# EAGLE design UV Sterlizer (EAGLE 9.6.1)
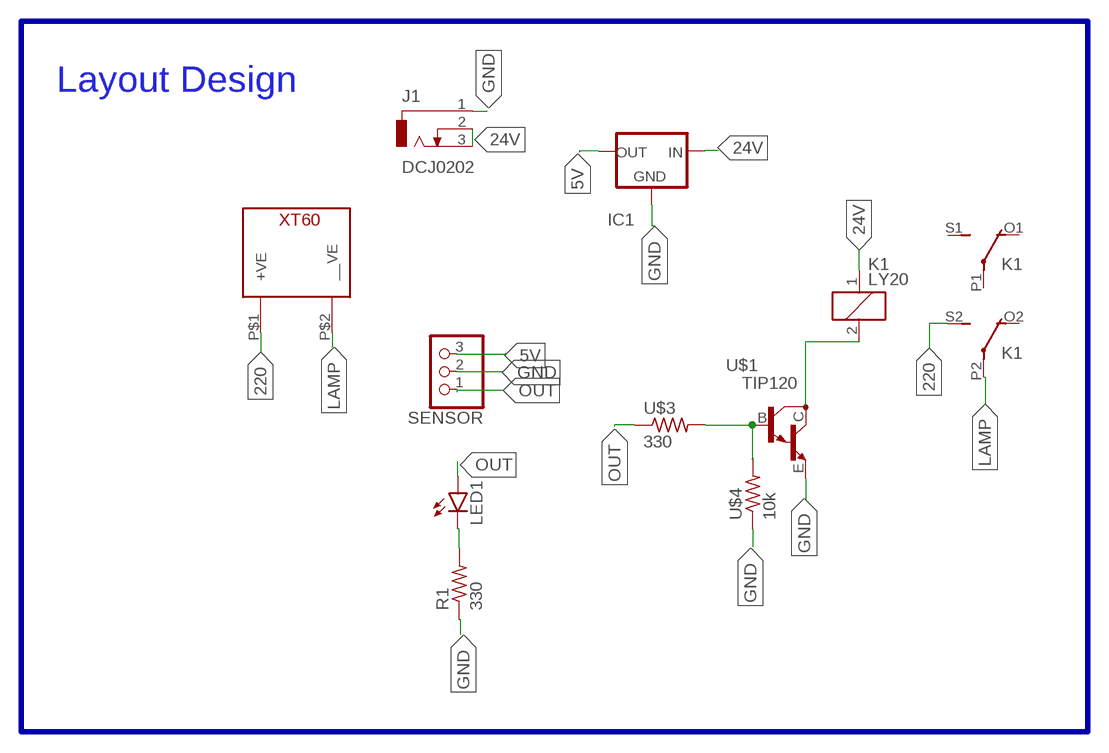
[diagram p0: schematic, sheet 1]

## Parts
IC1  78XX-METAL  [TO3-79]
J1  DCJ0202  [DCJ0202]
K1  LY20  [LY20]
LED1  LED5MM  [LED5MM]
R1  330  R-US_0204/7  [0204/7]
SENSOR  PINHD-1X3  [1X03]
U$1  TIP120  [TIP120]
U$3  330  RES-10  [0207/10]
U$4  10k  RES-10  [0207/10]
U$5  XT60_CONNECTOR  [XT60]

## Nets
5V: IC1.1(OUT) SENSOR.3
24V: IC1.3(IN) J1.2 J1.3 K1.1
220: K1.S2(3:S) U$5.P$1(+VE)
GND: IC1.2(GND) J1.1 R1.1 SENSOR.2 U$1.E U$4.1
LAMP: K1.P2(3:P) U$5.P$2(__VE)
N$1: K1.2 U$1.C
N$2: U$1.B U$3.2 U$4.2
N$3: LED1.K(C) R1.2
OUT: LED1.A SENSOR.1 U$3.1
Unconnected: K1.O1(2:O) K1.O2(3:O) K1.P1(2:P) K1.S1(2:S)

## Buses
B$1

## Notes on the sheet
- Layout Design

## Library data of the parts
IC1 = MIA_LIBRARY-2-2-2:78XX-METAL: VOLTAGE REGULATOR
J1 = con-jack:DCJ0202: DC POWER JACK Source: DCJ0202.pdf; OC_FARNELL: unknown; OC_NEWARK: unknown
K1 = relay:LY20: RELAY 2 x switch, Omron; OC_FARNELL: unknown; OC_NEWARK: unknown
LED1 = led:LED: LED OSRAM: - CHIPLED LG R971, LG N971, LY N971, LG Q971, LY Q971, LO R971, LY R971 LH N974, LH R974 LS Q976, LO Q976, LY Q976 LO Q996 - Hyper CHIPLED LW Q18S LB Q993, LB Q99A, LB R99A - SideLED LS A670, LO A670, LY A670, LG A670, LP A670 LB A673, LV A673, LT A673, LW A673 LH A674 LY A675 LS A676, LA A676, LO A676, LY A676, LW A676 LS A679, LY A679, LG A679 - Hyper Micro SIDELED® LS Y876, LA Y876, LO Y876, LY Y876 LT Y87S - SmartLED LW L88C, LW L88S LB L89C, LB L89S, LG L890 LS L89K, LO L89K, LY L89K LS L896, LA L896, LO L896, LY L896 - TOPLED LS T670, LO T670, LY T670, LG T670, LP T670 LSG T670, LSP T670, LSY T670, LOP T670, LYG T670 LG T671, LOG T671, LSG T671 LB T673, LV T673, LT T673, LW T673 LH T674 LS T676, LA T676, LO T676, LY T676, LB T676, LH T676, LSB T676, LW T676 LB T67C, LV T67C, LT T67C, LS T67K, LO T67K, LY T67K, LW E67C LS E67B, LA E67B, LO E67B, LY E67B, LB E67C, LV E67C, LT E67C LW T67C LS T679, LY T679, LG T679 LS T770, LO T770, LY T770, LG T770, LP T770 LB T773, LV T773, LT T773, LW T773 LH T774 LS E675, LA E675, LY E675, LS T675 LS T776, LA T776, LO T776, LY T776, LB T776 LHGB T686 LT T68C, LB T68C - Hyper Mini TOPLED® LB M676 - Mini TOPLED Santana® LG M470 LS M47K, LO M47K, LY M47K Source: http://www.osram.convergy.de LUXEON: - LUMILED® LXK2-PW12-R00, LXK2-PW12-S00, LXK2-PW14-U00, LXK2-PW14-V00 LXK2-PM12-R00, LXK2-PM12-S00, LXK2-PM14-U00 LXK2-PE12-Q00, LXK2-PE12-R00, LXK2-PE12-S00, LXK2-PE14-T00, LXK2-PE14-U00 LXK2-PB12-K00, LXK2-PB12-L00, LXK2-PB12-M00, LXK2-PB14-N00, LXK2-PB14-P00, LXK2-PB14-Q00 LXK2-PR12-L00, LXK2-PR12-M00, LXK2-PR14-Q00, LXK2-PR14-R00 LXK2-PD12-Q00, LXK2-PD12-R00, LXK2-PD12-S00 LXK2-PH12-R00, LXK2-PH12-S00 LXK2-PL12-P00, LXK2-PL12-Q00, LXK2-PL12-R00 Source: www.luxeon.com KINGBRIGHT: KA-3528ASYC Source: www.kingbright.com
R1 = rcl:R-US_: RESISTOR, American symbol; SPICEPREFIX: R
SENSOR = MIA_LIBRARY-2-2-2:PINHD-1X3: PIN HEADER
U$1 = MIA_LIBRARY-2-2-2:TIP120: pinhead
U$3 U$4 = MIA_LIBRARY-2-2-2:RES-10
U$5 = MIA_LIBRARY-2-2-2:XT60_CONNECTOR

## Board
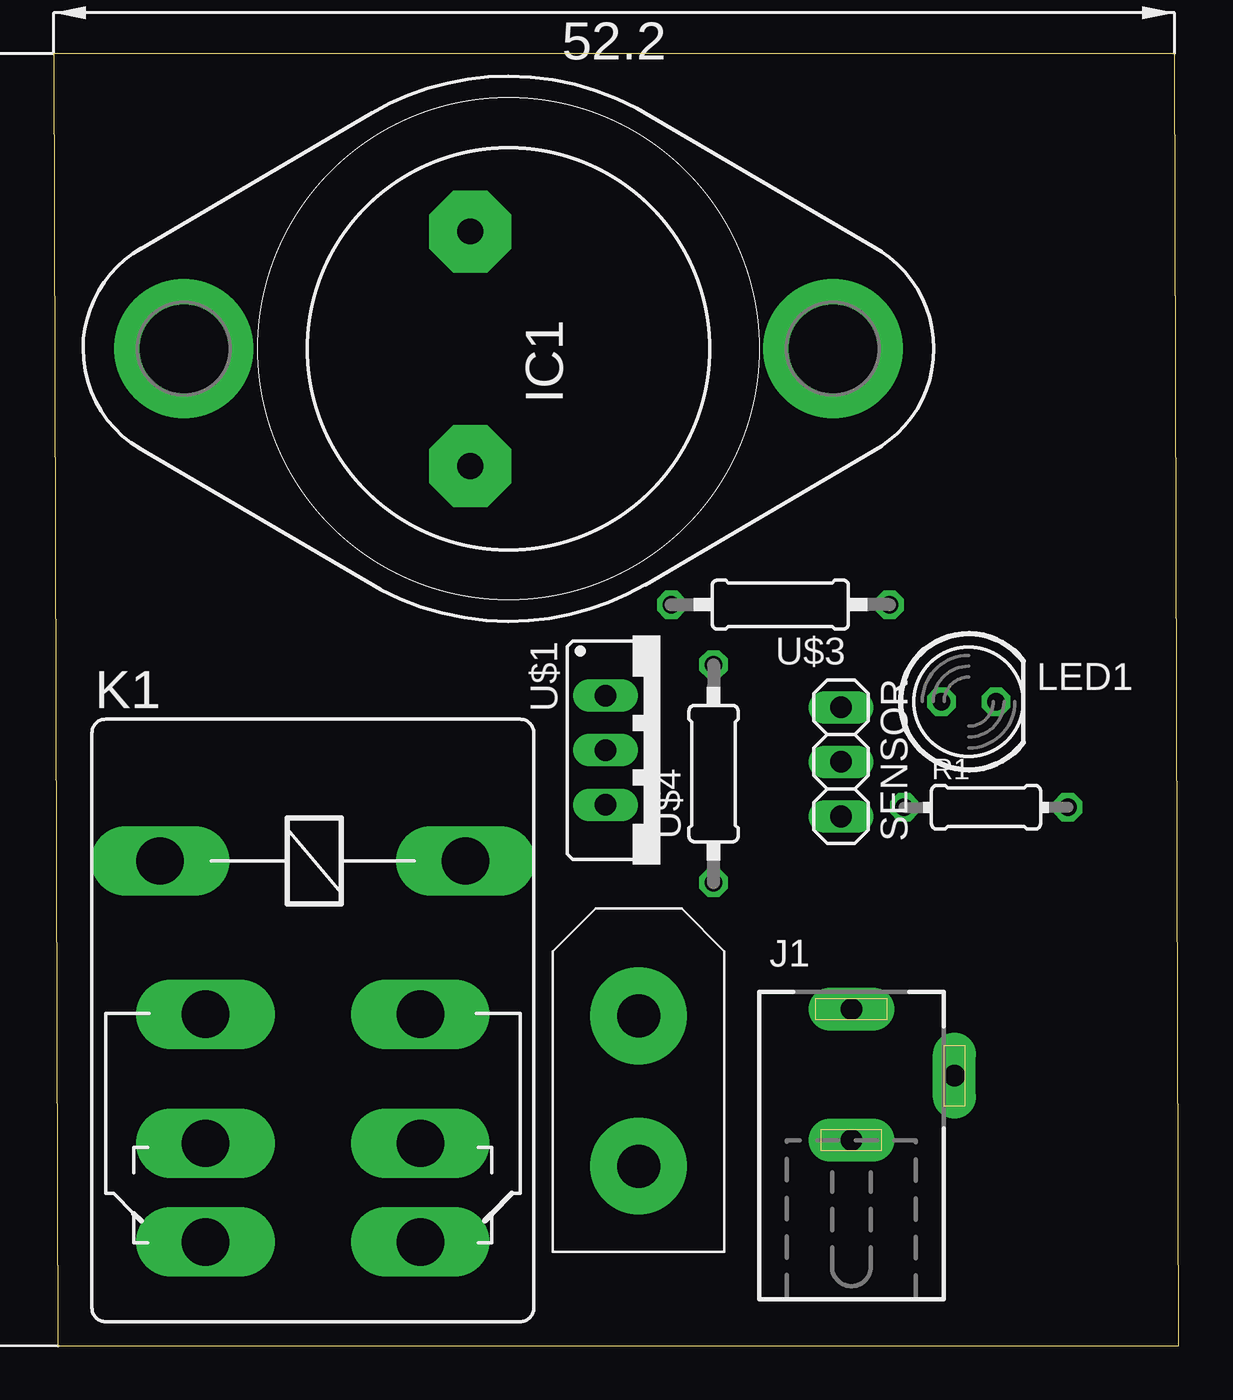
[diagram p1: board, top side]
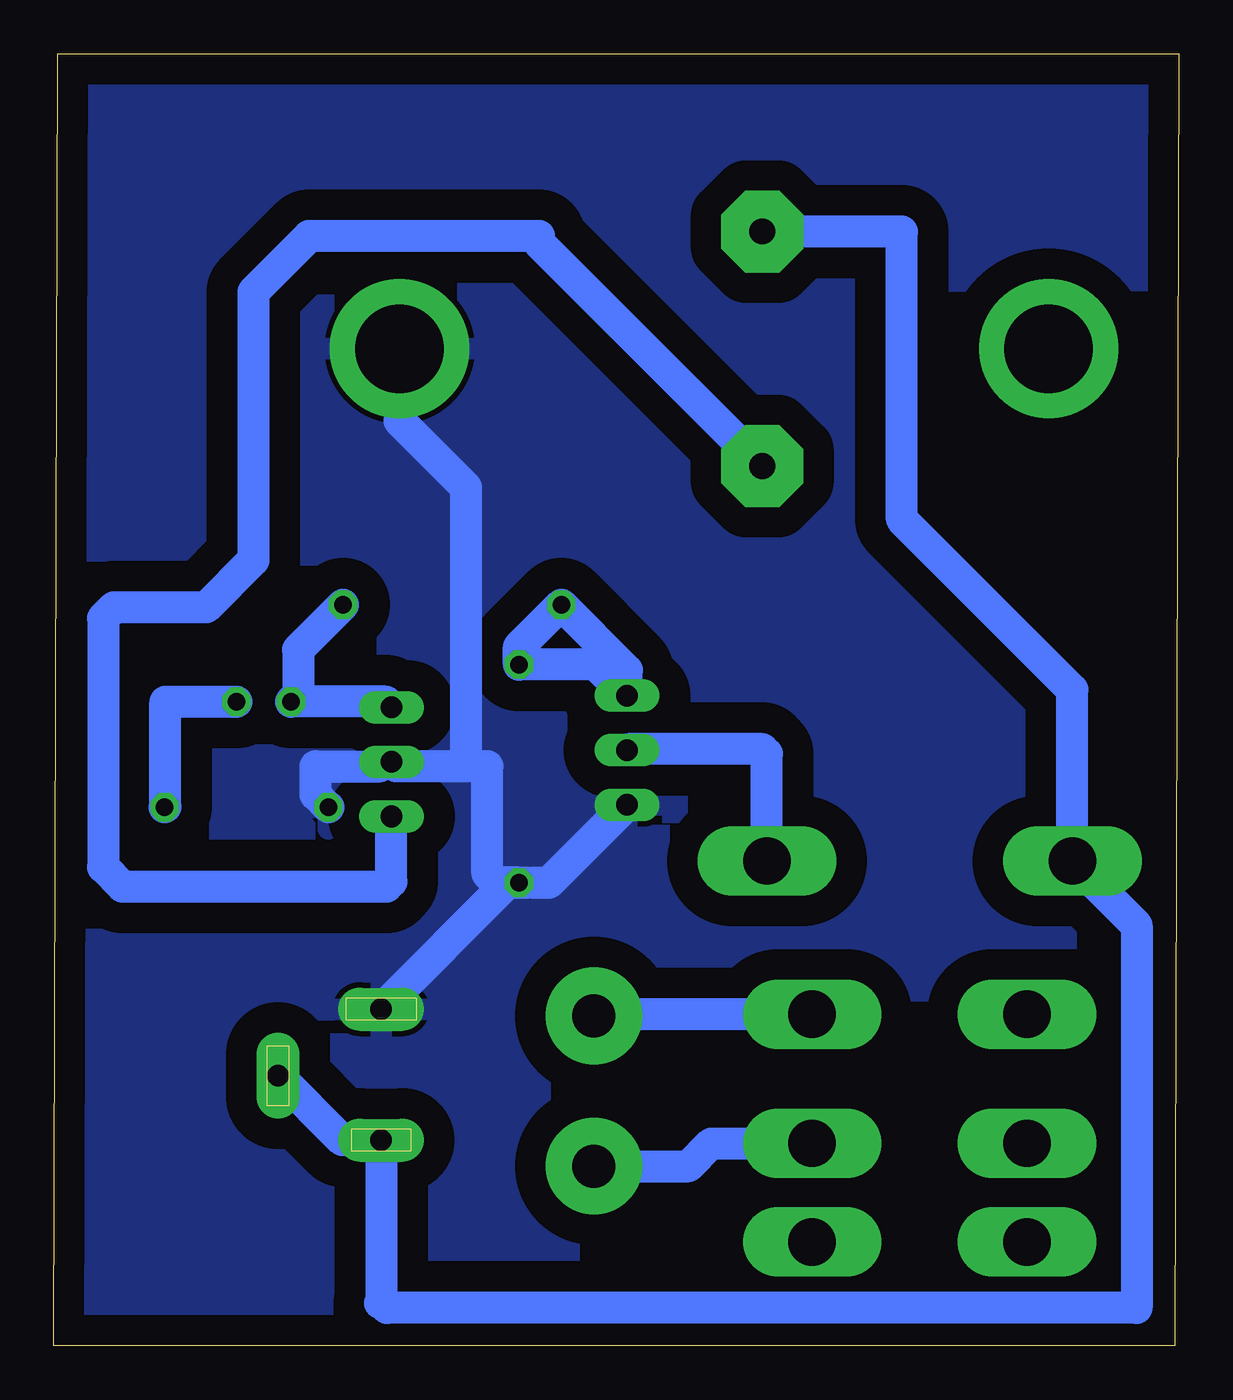
[diagram p2: board, bottom side, seen from below]

Size 52.4 x 60.2 mm. Coordinates in mm from the lower left corner, seen from the top.
Outline: 0.2,0 52.4,0 52.2,60.2 0,60.2 0.2,0
Copper layers (1*16): Top 0.035mm / dielectric 1.5mm / Bottom 0.035mm
Design rules "default *": minimum track width 1mm, minimum drill 0.35mm, track to track 0.8mm, track to pad 0.6mm, pad to pad 6mil, via to via 6mil, smd to smd 6mil, copper to edge 40mil, drill to drill 6mil, minimum pad ring 10mil, minimum via ring 8mil, stop-mask expansion 4mil, vias tented up to drill 0mil, thermal gap 10mil

### Footprints (pad centres in the part's own frame; a part is rotated, then mirrored left to right if it is on the bottom)
TO3-79 = drill 1.194 pad 3.81 octagon: 1 -1.778,-5.461; 3 -1.778,5.461 | drill 4.115 pad 6.477: 2 15.113,0; 3@ -15.113,0
DCJ0202 = drill 1 pad 2 long: 1 0,3.1; 2 4.8,0; 3 0,-3
LY20 = drill 2.21 long: 1 -7.112,0; 2 7.112,0; O1 -5.004,-17.755; O2 5.004,-17.755; P1 -5.004,-7.137; P2 5.004,-7.137; S1 -5.004,-13.157; S2 5.004,-13.157
LED5MM = drill 0.813 octagon: A -1.27,0; K 1.27,0
0204/7 = drill 0.813 octagon: 1 -3.81,0; 2 3.81,0
1X03 = drill 1.016 long: 1 -2.54,0; 2 0,0; 3 2.54,0
TIP120 = drill 1.016 long: B -2.54,-2.54; C 0,-2.54; E 2.54,-2.54
0207/10 = drill 0.813 octagon: 1 -5.08,0; 2 5.08,0
XT60 = drill 2 pad 4.5: P$1 -4,-4; P$2 -11,-4

### Placement (x,y rotation side)
IC1  21.18,46.45 0 top
J1  37.15,12.58 0 top
K1  12.07,22.59 0 top
LED1  42.61,30.01 0 top
R1  43.42,25.09 0 top
SENSOR  36.67,27.21 270 top
U$1  28.24,27.75 270 top
U$3  33.84,34.53 180 top
U$4  30.73,26.66 90 top
U$5  31.24,4.37 270 top

### Tracks (layer width: path | path; a pad name or v marks a point on that pad's centre or on a via)
5V
  Bottom 1.5: IC1.1 29.8,51.39 29.8,51.7 40.5,51.7 43.1,49.1 43.1,36.6 45.3,34.4 49.6,34.4 50.1,33.9 50.1,22.3 49.2,21.4 36.9,21.4 36.67,21.63 SENSOR.3
24V
  Bottom 1.5: J1.2 38.95,9.58 J1.3 37.15,2.05 | 37.15,2.05 37.2,2 | 37.15,2.05 36.87,1.77 1.97,1.77 1.97,19.6 K1.1 4.96,30.56 12.9,38.5 12.9,51.9 12.91,51.91 IC1.3
220
  Bottom 1.5: U$5.P$1 22.83,8.37 21.77,9.43 K1.S2
GND
  Bottom 1.5: R1.1 40.2,25.68 40.2,27 37.2,27 36.99,27.21 SENSOR.2 36.46,27 33.2,27 | IC1.2 36.29,43.09 33.2,40 33.2,27 | U$4.1 31.78,21.58 32.2,22 32.2,27 33.2,27 | J1.1 31.25,21.58 U$4.1 | U$4.1 29.33,21.58 U$1.E
  pour Bottom (isolate 1.422): 58.1,68 62.2,63.9 62.2,0.8 55,-6.4 52.6,-8.8 -8.4,-8.8 -12.3,-4.9 -12.3,68.3
LAMP
  Bottom 1.5: K1.P2 27.16,15.45 U$5.P$2
N$1
  Bottom 1.5: K1.2 19.18,27.58 19.4,27.8 25.65,27.8 U$1.C
N$2
  Bottom 1.5: U$4.2 30.73,32.56 U$3.2 25.7,31.47 U$1.B 27.15,31.74 U$4.2
N$3
  Bottom 1.5: R1.2 47.2,25.12 47.2,30 47.19,30.01 LED1.K
OUT
  Bottom 1.5: U$3.1 41.02,32.43 41.02,30.33 LED1.A 36.93,30.01 SENSOR.1